# EAGLE design M220noadder (EAGLE 6.6.0)
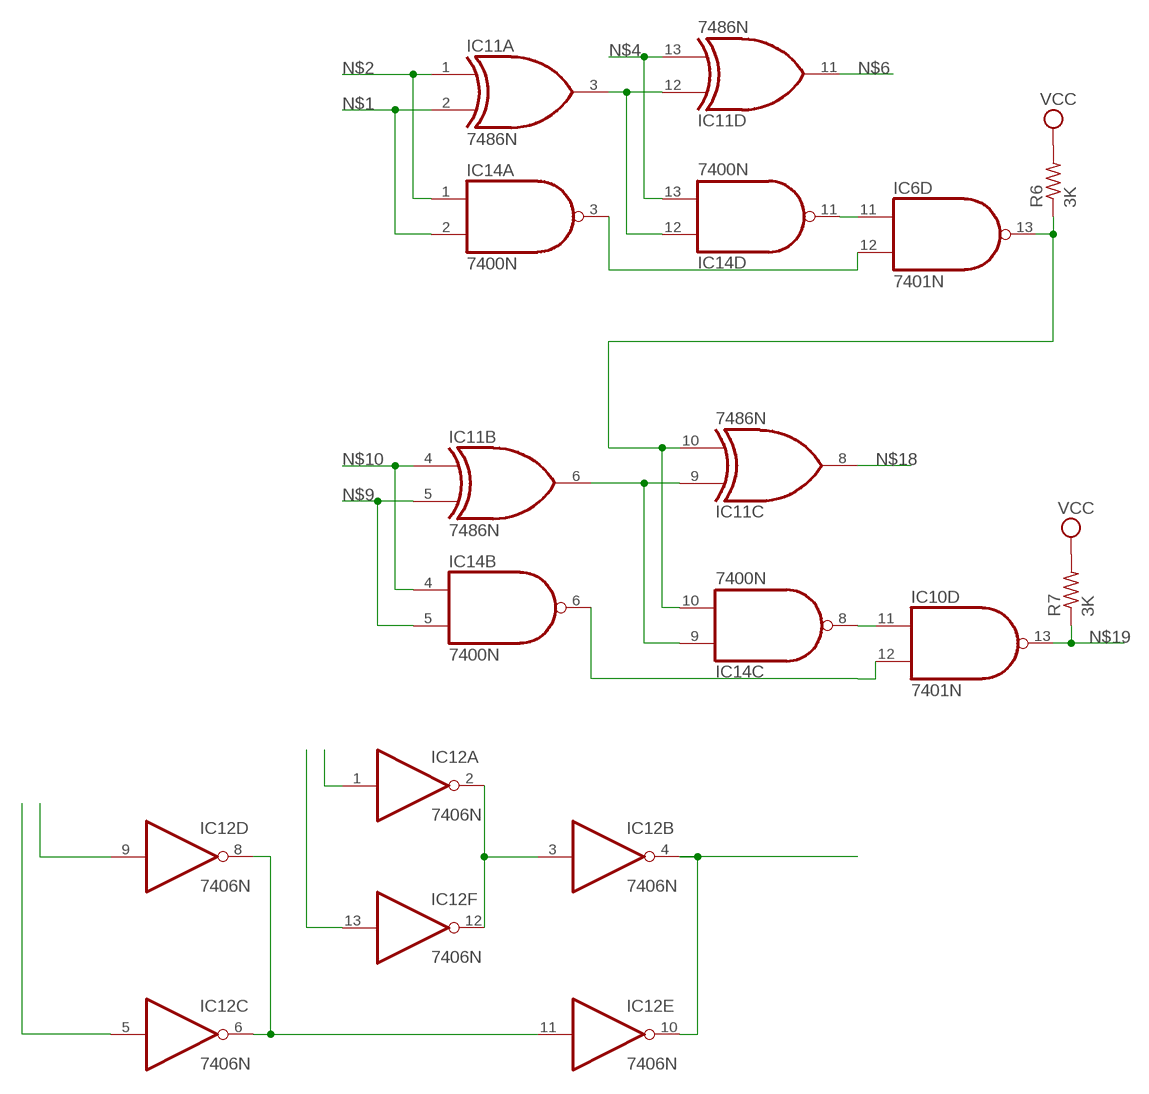
[diagram p0: schematic, sheet 1, part 1 of 2]
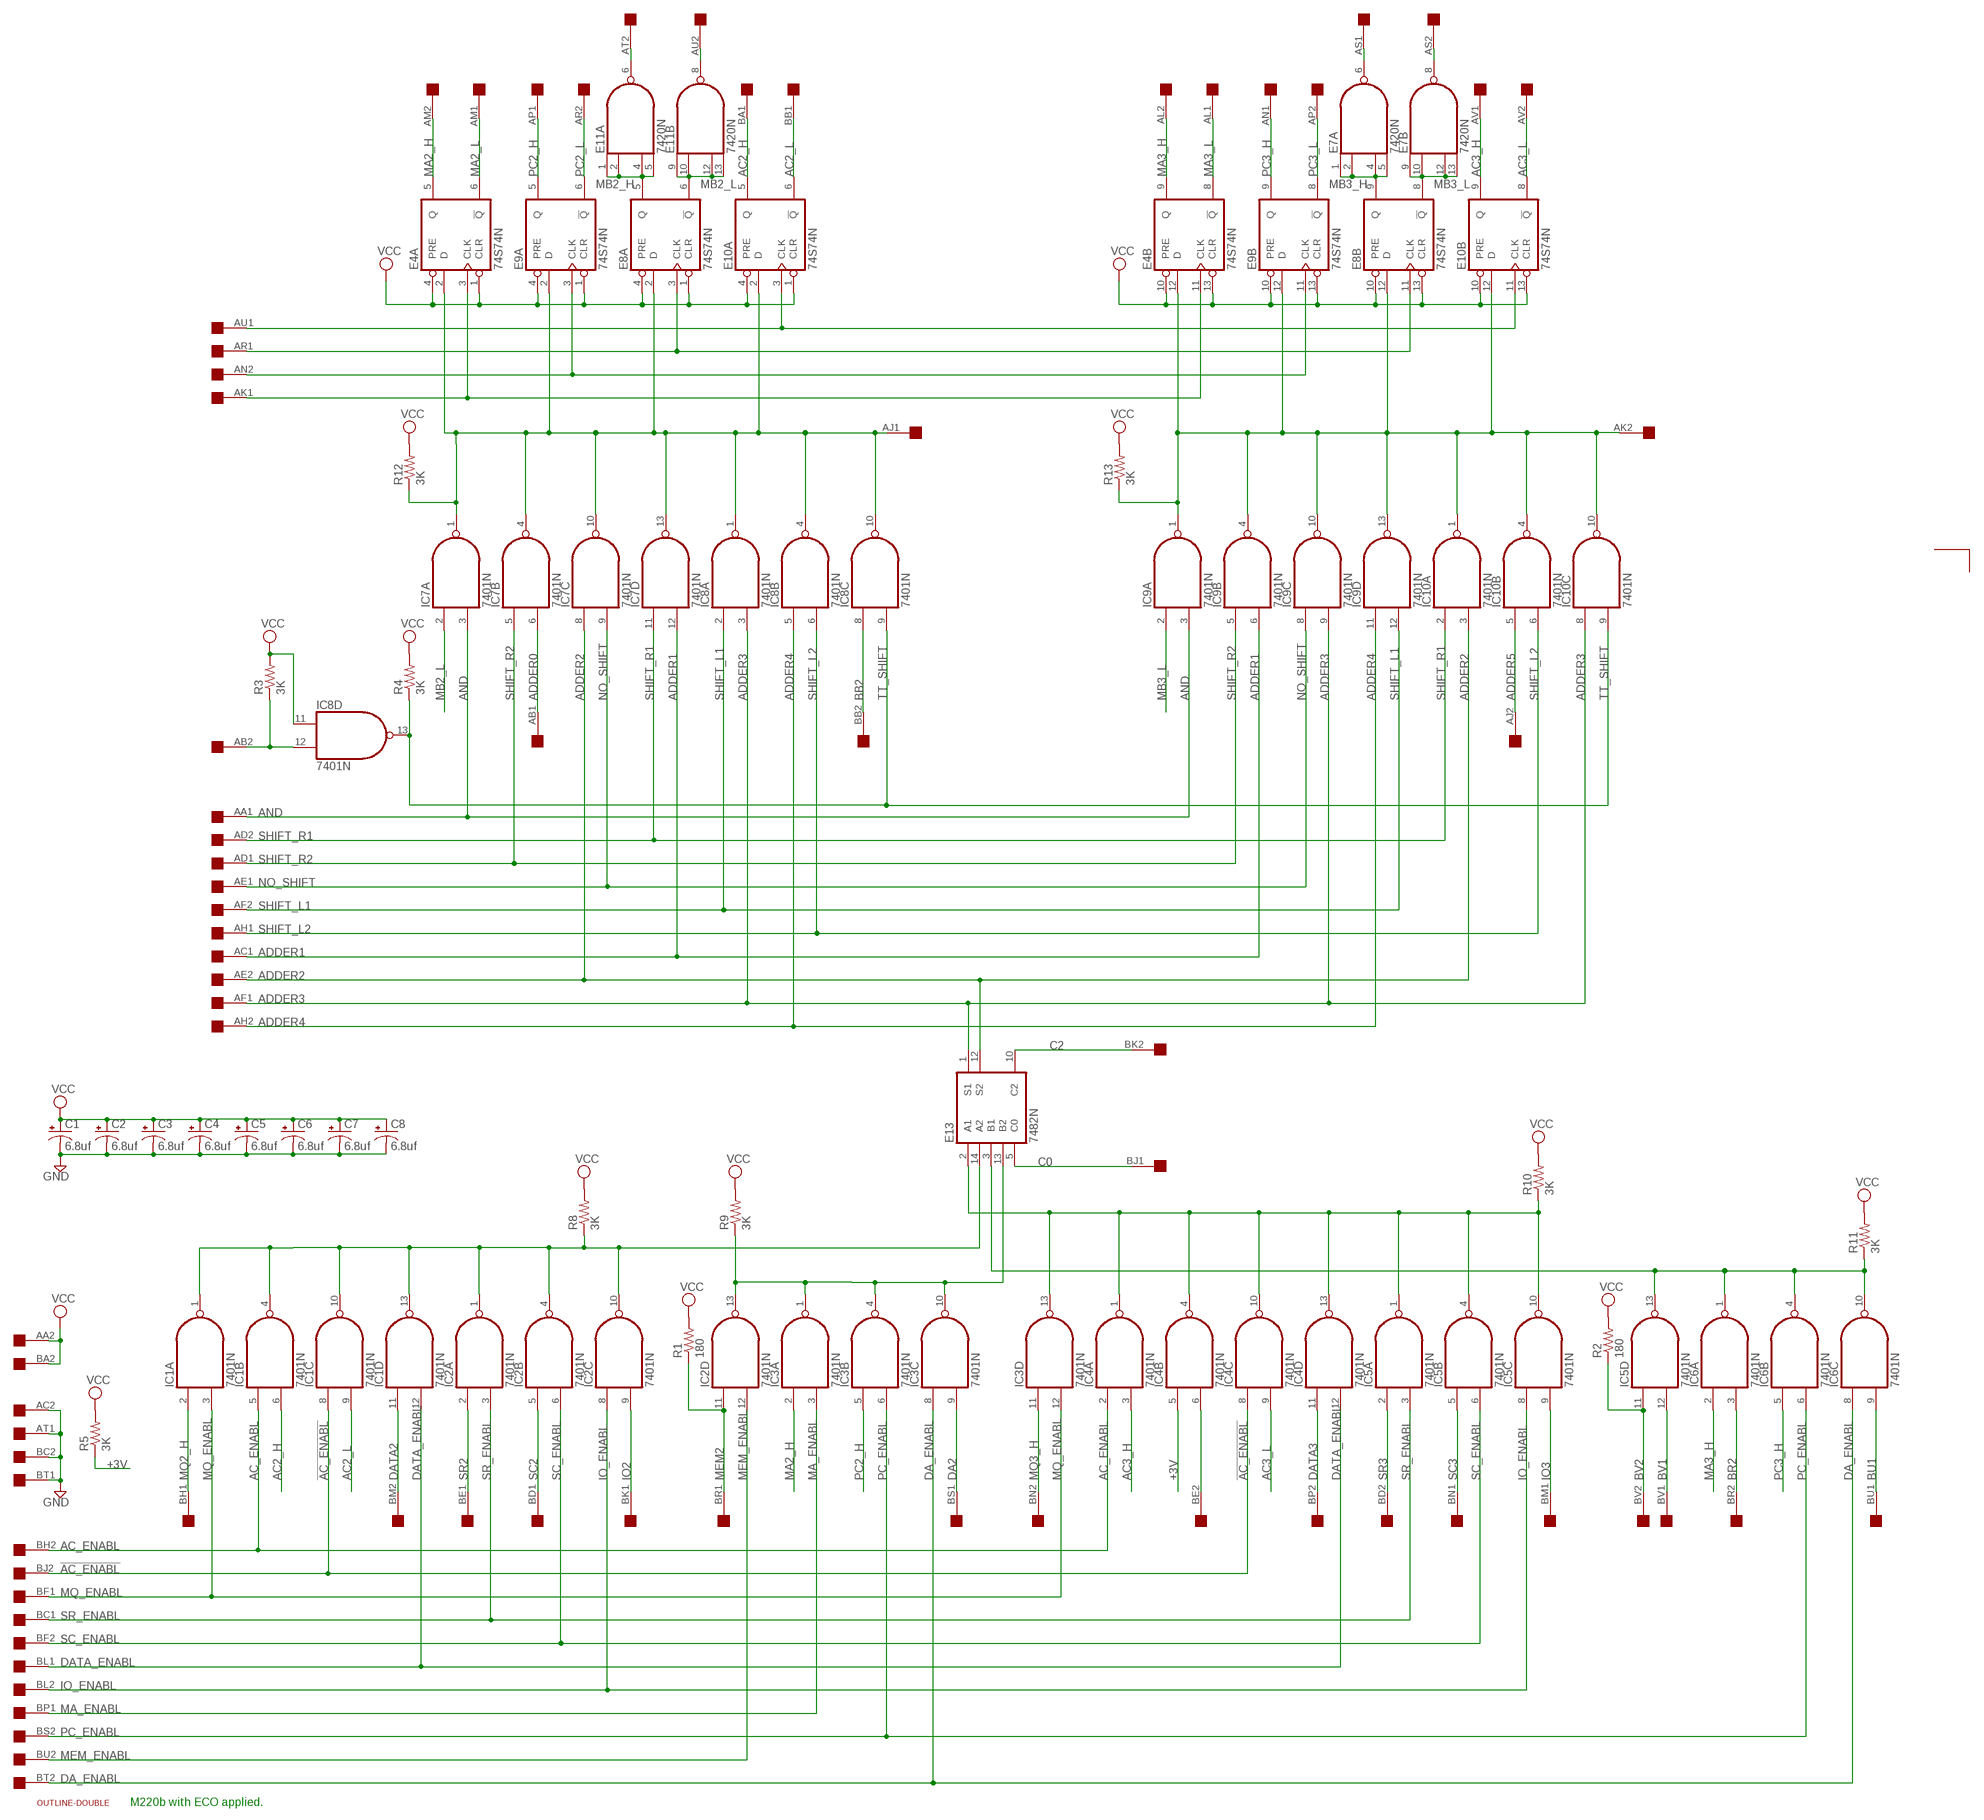
[diagram p1: schematic, sheet 1, part 2 of 2]

## Parts
C1  6.8uf  CPOL-USE15-5AXIAL  [E15-5]
C2  6.8uf  CPOL-USE15-5AXIAL  [E15-5]
C3  6.8uf  CPOL-USE15-5AXIAL  [E15-5]
C4  6.8uf  CPOL-USE15-5AXIAL  [E15-5]
C5  6.8uf  CPOL-USE15-5AXIAL  [E15-5]
C6  6.8uf  CPOL-USE15-5AXIAL  [E15-5]
C7  6.8uf  CPOL-USE15-5AXIAL  [E15-5]
C8  6.8uf  CPOL-USE15-5AXIAL  [E15-5]
E4  74S74N  [DIL14]
E7  7420N  74S20N  [DIL14]
E8  74S74N  [DIL14]
E9  74S74N  [DIL14]
E10  74S74N  [DIL14]
E11  7420N  74S20N  [DIL14]
E13  7482N  [DIL14]
IC1  7401N  [DIL14]
IC2  7401N  [DIL14]
IC3  7401N  [DIL14]
IC4  7401N  [DIL14]
IC5  7401N  [DIL14]
IC6  7401N  [DIL14]
IC7  7401N  [DIL14]
IC8  7401N  [DIL14]
IC9  7401N  [DIL14]
IC10  7401N  [DIL14]
IC11  7486N  [DIL14]
IC12  7406N  [DIL14]
IC14  7400N  [DIL14]
R1  180  R-US_0207/10  [0207/10]
R2  180  R-US_0207/10  [0207/10]
R3  3K  R-US_0207/10  [0207/10]
R4  3K  R-US_0207/10  [0207/10]
R5  3K  R-US_0207/10  [0207/10]
R6  3K  R-US_0207/10  [0207/10]
R7  3K  R-US_0207/10  [0207/10]
R8  3K  R-US_0207/10  [0207/10]
R9  3K  R-US_0207/10  [0207/10]
R10  3K  R-US_0207/10  [0207/10]
R11  3K  R-US_0207/10  [0207/10]
R12  3K  R-US_0207/10  [0207/10]
R13  3K  R-US_0207/10  [0207/10]
U$1  DOUBLE  [EDGE-CON4]
U$2  OUTLINE-DOUBLE  [DOUBLE]

## Nets
!AC_ENABL: IC1.8(C:I0) IC4.8(C:I0) U$1.BJ2
!TT_SHIFT: IC8.12(D:I1) R3.1 U$1.AB2
+3V: IC4.5(B:I0) R5.1
AC2_H: E10.5(A:Q) IC1.6(B:I1) U$1.BA1
AC2_L: E10.6(A:!Q) IC1.9(C:I1) U$1.BB1
AC3_H: E10.9(B:Q) IC4.3(A:I1) U$1.AV1
AC3_L: E10.8(B:!Q) IC4.9(C:I1) U$1.AV2
AC_ENABL: IC1.5(B:I0) IC4.2(A:I0) U$1.BH2
ADDER0: IC7.6(B:I1) U$1.AB1
ADDER1: IC7.12(D:I1) IC9.6(B:I1) U$1.AC1
ADDER2: E13.12(S2) IC7.8(C:I0) IC10.3(A:I1) U$1.AE2
ADDER3: E13.1(S1) IC8.3(A:I1) IC9.9(C:I1) IC10.8(C:I0) U$1.AF1
ADDER4: IC8.5(B:I0) IC9.11(D:I0) U$1.AH2
ADDER5: IC10.5(B:I0) U$1.AJ2
AJ1: E4.2(A:D) E8.2(A:D) E9.2(A:D) E10.2(A:D) IC7.1(A:O) IC7.4(B:O) IC7.10(C:O) IC7.13(D:O) IC8.1(A:O) IC8.4(B:O) IC8.10(C:O) R12.1 U$1.AJ1
AK1: E4.3(A:CLK) E4.11(B:CLK) U$1.AK1
AK2: E4.12(B:D) E8.12(B:D) E9.12(B:D) E10.12(B:D) IC9.1(A:O) IC9.4(B:O) IC9.10(C:O) IC9.13(D:O) IC10.1(A:O) IC10.4(B:O) IC10.10(C:O) R13.1 U$1.AK2
AN2: E9.3(A:CLK) E9.11(B:CLK) U$1.AN2
AND: IC7.3(A:I1) IC9.3(A:I1) U$1.AA1
AR1: E8.3(A:CLK) E8.11(B:CLK) U$1.AR1
AS1: E7.6(A:O) U$1.AS1
AS2: E7.8(B:O) U$1.AS2
AT2: E11.6(A:O) U$1.AT2
AU1: E10.3(A:CLK) E10.11(B:CLK) U$1.AU1
AU2: E11.8(B:O) U$1.AU2
BB2: IC8.8(C:I0) U$1.BB2
BE2: IC4.6(B:I1) U$1.BE2
BR2: IC6.3(A:I1) U$1.BR2
BU1: IC6.9(C:I1) U$1.BU1
BV1: IC5.12(D:I1) U$1.BV1
BV2: IC5.11(D:I0) R2.1 U$1.BV2
C0: E13.5(C0) U$1.BJ1
C2: E13.10(C2) U$1.BK2
DA2: IC3.9(C:I1) U$1.BS1
DA_ENABL: IC3.8(C:I0) IC6.8(C:I0) U$1.BT2
DATA2: IC1.11(D:I0) U$1.BM2
DATA3: IC4.11(D:I0) U$1.BP2
DATA_ENABL: IC1.12(D:I1) IC4.12(D:I1) U$1.BL1
GND: C1.- C2.- C3.- C4.- C5.- C6.- C7.- C8.- U$1.AC2 U$1.AT1 U$1.BC2 U$1.BT1
IO2: IC2.9(C:I1) U$1.BK1
IO3: IC5.9(C:I1) U$1.BM1
IO_ENABL: IC2.8(C:I0) IC5.8(C:I0) U$1.BL2
MA2_H: E4.5(A:Q) IC3.2(A:I0) U$1.AM2
MA2_L: E4.6(A:!Q) U$1.AM1
MA3_H: E4.9(B:Q) IC6.2(A:I0) U$1.AL2
MA3_L: E4.8(B:!Q) U$1.AL1
MA_ENABL: IC3.3(A:I1) U$1.BP1
MB2_H: E8.5(A:Q) E11.1(A:I0) E11.2(A:I1) E11.4(A:I2) E11.5(A:I3)
MB2_L: E8.6(A:!Q) E11.9(B:I0) E11.10(B:I1) E11.12(B:I2) E11.13(B:I3) IC7.2(A:I0)
MB3_H: E7.1(A:I0) E7.2(A:I1) E7.4(A:I2) E7.5(A:I3) E8.9(B:Q)
MB3_L: E7.9(B:I0) E7.10(B:I1) E7.12(B:I2) E7.13(B:I3) E8.8(B:!Q) IC9.2(A:I0)
MEM2: IC2.11(D:I0) R1.1 U$1.BR1
MEM_ENABL: IC2.12(D:I1) U$1.BU2
MQ2_H: IC1.2(A:I0) U$1.BH1
MQ3_H: IC3.11(D:I0) U$1.BN2
MQ_ENABL: IC1.3(A:I1) IC3.12(D:I1) U$1.BF1
N$1: IC11.2(A:I1) IC14.2(A:I1)
N$2: IC11.1(A:I0) IC14.1(A:I0)
N$3: IC11.3(A:O) IC11.12(D:I0) IC14.12(D:I0)
N$4: IC11.13(D:I1) IC14.13(D:I1)
N$5: E13.14(A2) IC1.1(A:O) IC1.4(B:O) IC1.10(C:O) IC1.13(D:O) IC2.1(A:O) IC2.4(B:O) IC2.10(C:O) R8.1
N$6: IC11.11(D:O)
N$7: IC6.12(D:I1) IC14.3(A:O)
N$8: E13.2(A1) IC3.13(D:O) IC4.1(A:O) IC4.4(B:O) IC4.10(C:O) IC4.13(D:O) IC5.1(A:O) IC5.4(B:O) IC5.10(C:O) R10.1
N$9: IC11.5(B:I1) IC14.5(B:I1)
N$10: IC11.4(B:I0) IC14.4(B:I0)
N$11: IC11.6(B:O) IC11.9(C:I0) IC14.9(C:I0)
N$12: E13.13(B2) IC2.13(D:O) IC3.1(A:O) IC3.4(B:O) IC3.10(C:O) R9.1
N$13: IC6.13(D:O) IC11.10(C:I1) IC14.10(C:I1) R6.1
N$14: E13.3(B1) IC5.13(D:O) IC6.1(A:O) IC6.4(B:O) IC6.10(C:O) R11.1
N$15: IC10.12(D:I1) IC14.6(B:O)
N$16: IC6.11(D:I0) IC14.11(D:O)
N$17: IC10.11(D:I0) IC14.8(C:O)
N$18: IC11.8(C:O)
N$19: IC10.13(D:O) R7.1
N$20: IC12.5(C:I)
N$21: IC12.9(D:I)
N$22: IC12.6(C:O) IC12.8(D:O) IC12.11(E:I)
N$23: IC12.13(F:I)
N$24: IC12.1(A:I)
N$25: IC12.2(A:O) IC12.3(B:I) IC12.12(F:O)
N$26: IC12.4(B:O) IC12.10(E:O)
NO_SHIFT: IC7.9(C:I1) IC9.8(C:I0) U$1.AE1
PC2_H: E9.5(A:Q) IC3.5(B:I0) U$1.AP1
PC2_L: E9.6(A:!Q) U$1.AR2
PC3_H: E9.9(B:Q) IC6.5(B:I0) U$1.AN1
PC3_L: E9.8(B:!Q) U$1.AP2
PC_ENABL: IC3.6(B:I1) IC6.6(B:I1) U$1.BS2
SC2: IC2.5(B:I0) U$1.BD1
SC3: IC5.5(B:I0) U$1.BN1
SC_ENABL: IC2.6(B:I1) IC5.6(B:I1) U$1.BF2
SHIFT_L1: IC8.2(A:I0) IC9.12(D:I1) U$1.AF2
SHIFT_L2: IC8.6(B:I1) IC10.6(B:I1) U$1.AH1
SHIFT_R1: IC7.11(D:I0) IC10.2(A:I0) U$1.AD2
SHIFT_R2: IC7.5(B:I0) IC9.5(B:I0) U$1.AD1
SR2: IC2.2(A:I0) U$1.BE1
SR3: IC5.2(A:I0) U$1.BD2
SR_ENABL: IC2.3(A:I1) IC5.3(A:I1) U$1.BC1
TT_SHIFT: IC8.9(C:I1) IC8.13(D:O) IC10.9(C:I1) R4.1
VCC: C1.+ C2.+ C3.+ C4.+ C5.+ C6.+ C7.+ C8.+ E4.1(A:CLR) E4.4(A:PRE) E4.10(B:PRE) E4.13(B:CLR) E8.1(A:CLR) E8.4(A:PRE) E8.10(B:PRE) E8.13(B:CLR) E9.1(A:CLR) E9.4(A:PRE) E9.10(B:PRE) E9.13(B:CLR) E10.1(A:CLR) E10.4(A:PRE) E10.10(B:PRE) E10.13(B:CLR) IC8.11(D:I0) R1.2 R2.2 R3.2 R4.2 R5.2 R6.2 R7.2 R8.2 R9.2 R10.2 R11.2 R12.2 R13.2 U$1.AA2 U$1.BA2

## Notes on the sheet
- M220b with ECO applied.

## Power pins joined to a net without a drawn wire
GND: E4.7(P:GND) E7.7(P:GND) E8.7(P:GND) E9.7(P:GND) E10.7(P:GND) E11.7(P:GND) E13.7(GND) IC1.7(P:GND) IC2.7(P:GND) IC3.7(P:GND) IC4.7(P:GND) IC5.7(P:GND) IC6.7(P:GND) IC7.7(P:GND) IC8.7(P:GND) IC9.7(P:GND) IC10.7(P:GND) IC11.7(P:GND) IC12.7(P:GND) IC14.7(P:GND)
VCC: E4.14(P:VCC) E7.14(P:VCC) E8.14(P:VCC) E9.14(P:VCC) E10.14(P:VCC) E11.14(P:VCC) E13.4(VCC) IC1.14(P:VCC) IC2.14(P:VCC) IC3.14(P:VCC) IC4.14(P:VCC) IC5.14(P:VCC) IC6.14(P:VCC) IC7.14(P:VCC) IC8.14(P:VCC) IC9.14(P:VCC) IC10.14(P:VCC) IC11.14(P:VCC) IC12.14(P:VCC) IC14.14(P:VCC)

## Library data of the parts
C1-C8 = rcl:CPOL-US: POLARIZED CAPACITOR, American symbol
E4 E8-E10 = 74xx-us:74*74: Dual D type positive edge triggered FLIP FLOP, preset and clear
E7 E11 = 74xx-jameco:74*20: Dual 4-input NAND gate
E13 = 74xx-eu:74*82: 2-bit binary full ADDER
IC1-IC10 = 74xx-jameco:74*01: Quad 2-input NAND gate, open collector
IC11 = 74xx-jameco:74*86: Quad 2-input EXCLUSIV-OR (XOR) gate
IC12 = 74xx-jameco:74*06: Hex INVERTER, open collector high-voltage output
IC14 = 74xx-jameco:74*00: Quad 2-input NAND gate
R1-R13 = rcl:R-US_: RESISTOR, American symbol
U$1 = dec-con:DOUBLE: Double-Height DEC board
U$2 = dec-con:OUTLINE-*: Board outlines for DEC boards.

## Board
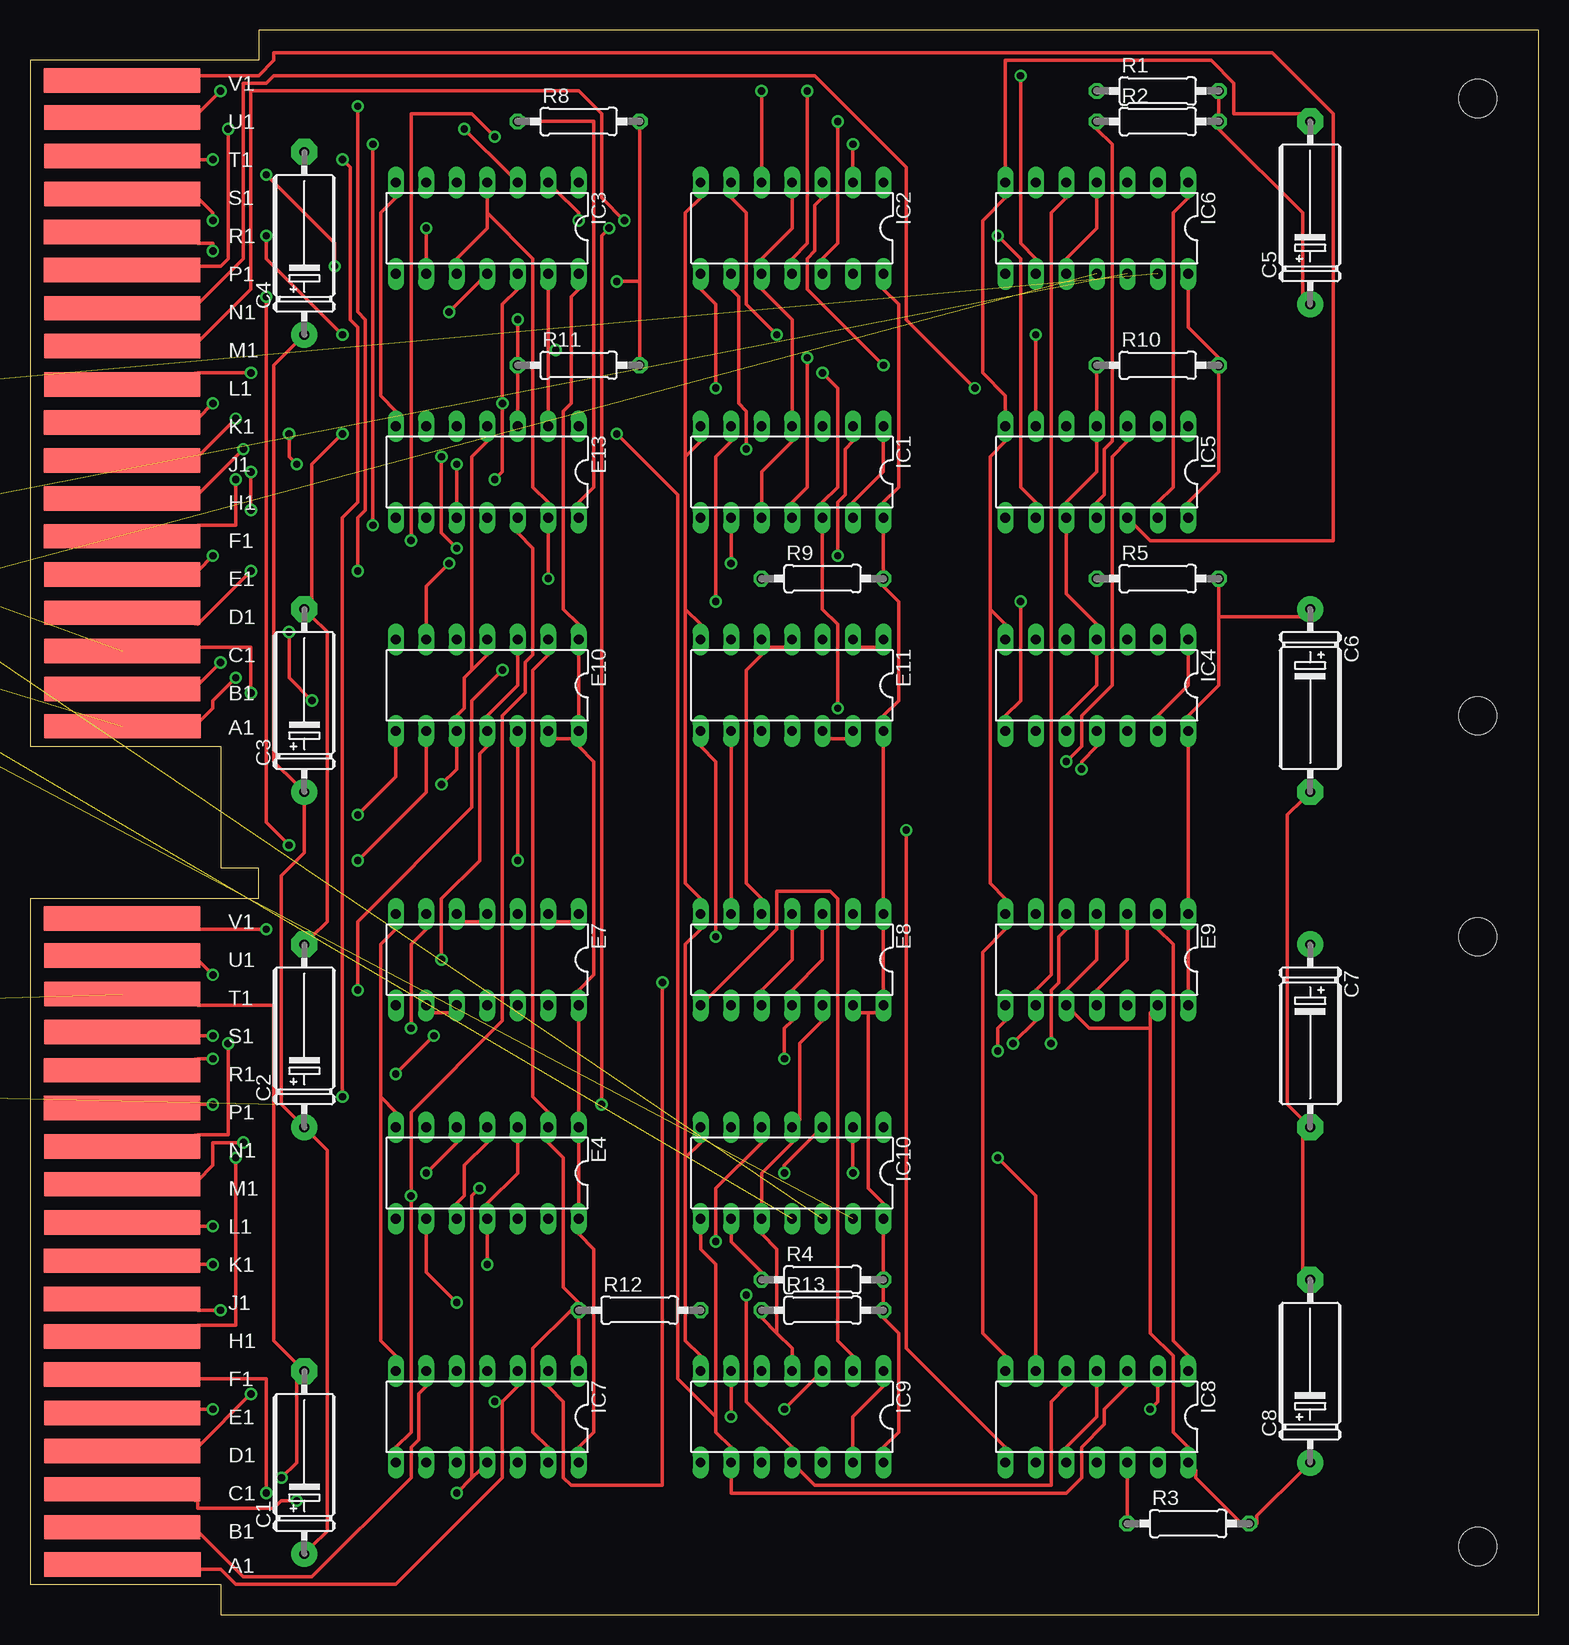
[diagram p2: board, top side]
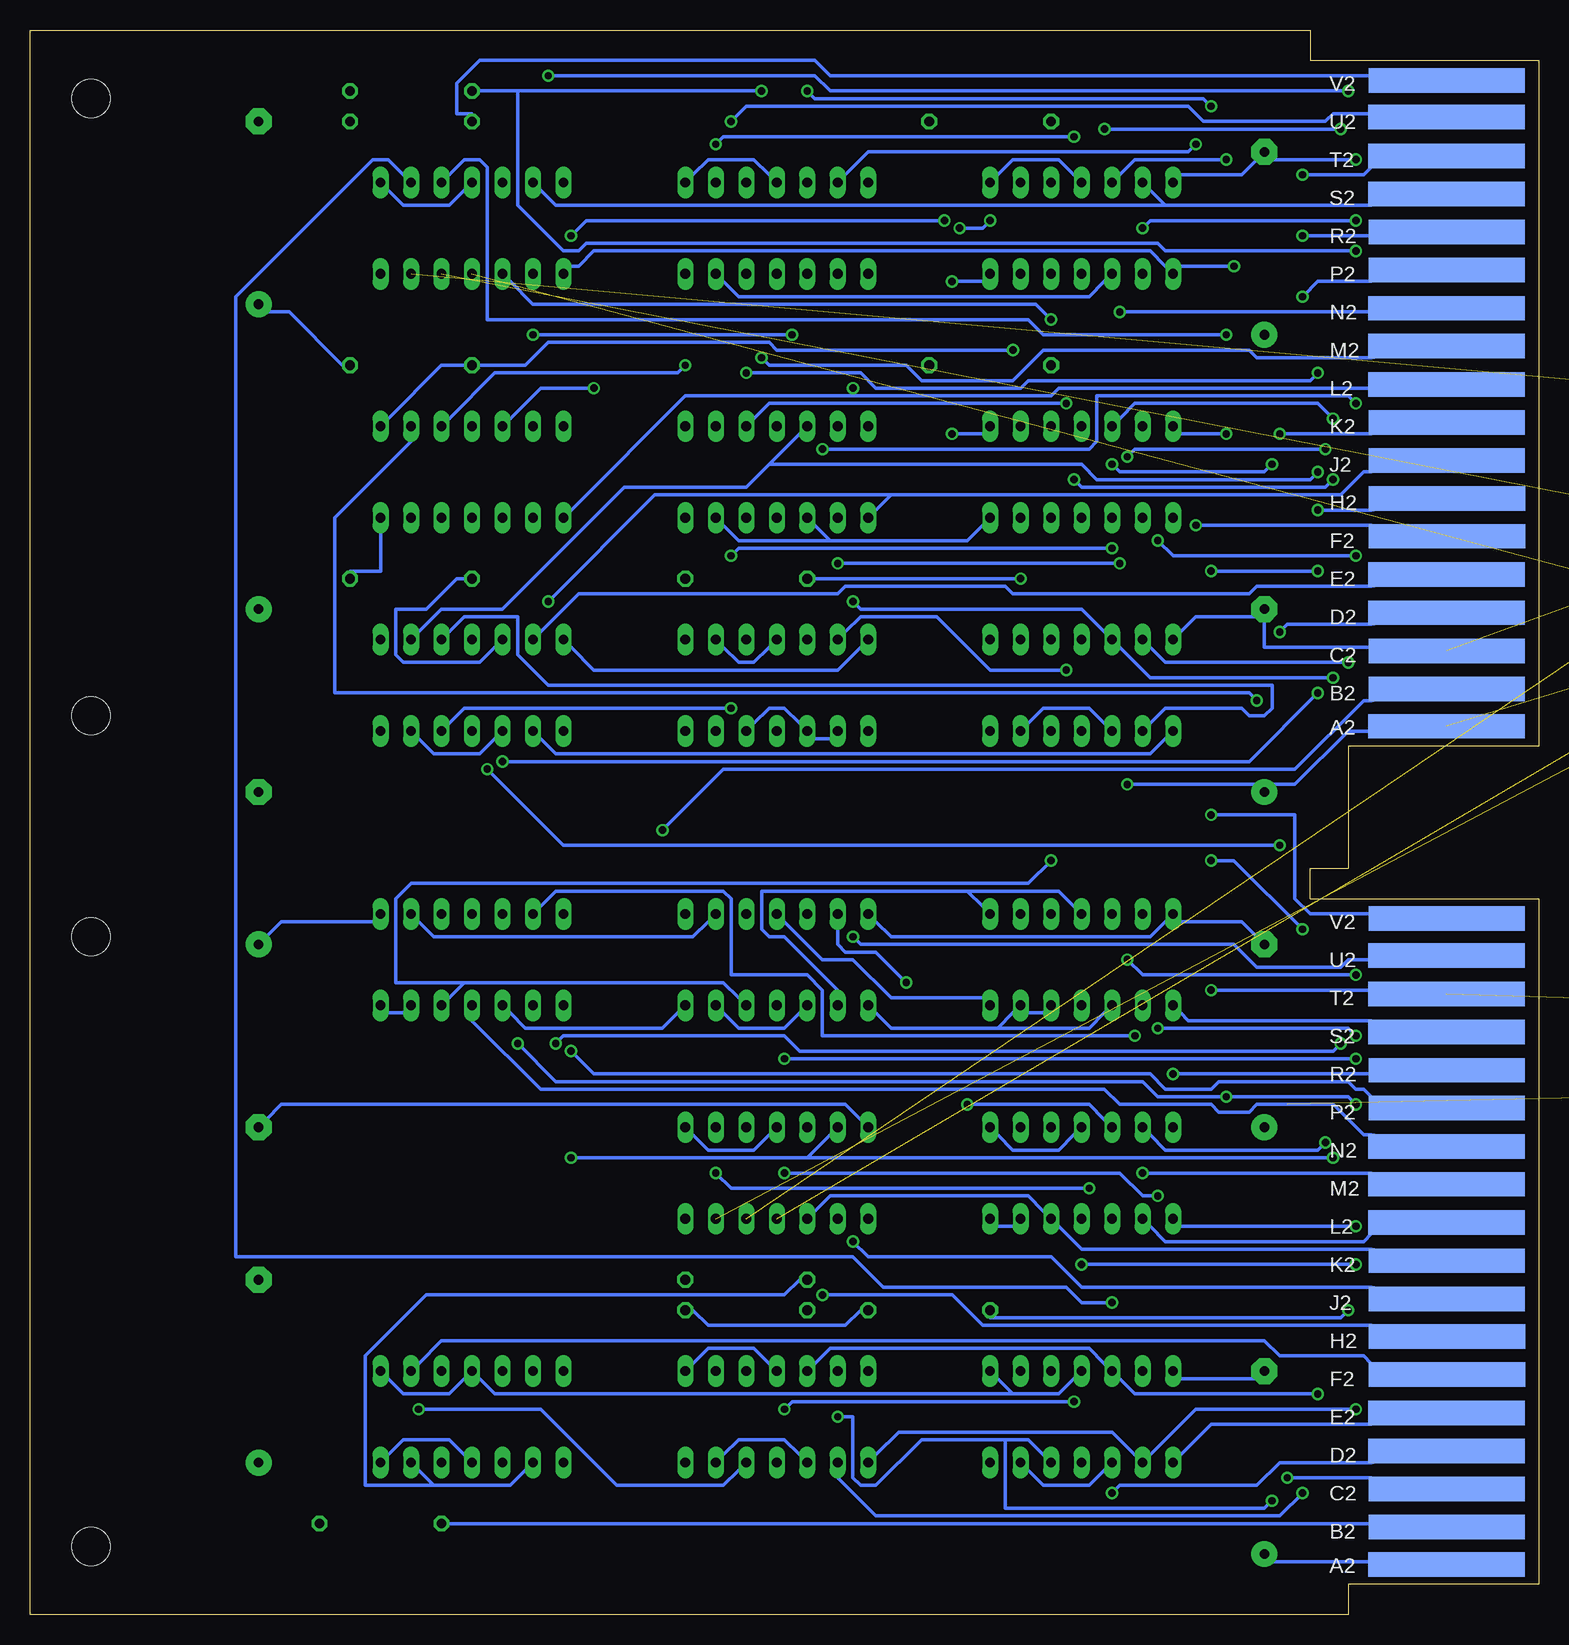
[diagram p3: board, bottom side, seen from below]

Size 125.73 x 132.08 mm. Coordinates in mm from the lower left corner, seen from the top.
Copper layers (1*16): Top 0.035mm / dielectric 1.5mm / Bottom 0.035mm
Design rules "olimex10mil": minimum track width 12mil, minimum drill 24mil, track to track 12mil, track to pad 12mil, pad to pad 12mil, via to via 12mil, smd to smd 10mil, copper to edge 25mil, drill to drill 10mil, minimum pad ring 10mil, minimum via ring 8mil, stop-mask expansion 0mil, vias tented up to drill 0mil, thermal gap 10mil

### Footprints (pad centres in the part's own frame; a part is rotated, then mirrored left to right if it is on the bottom)
E15-5 = drill 0.813 pad 2.159: + -7.62,0 | drill 0.813 pad 2.159 octagon: - 7.62,0
DIL14 = drill 0.813 long: 1 -7.62,-3.81; 2 -5.08,-3.81; 3 -2.54,-3.81; 4 0,-3.81; 5 2.54,-3.81; 6 5.08,-3.81; 7 7.62,-3.81; 8 7.62,3.81; 9 5.08,3.81; 10 2.54,3.81; 11 0,3.81; 12 -2.54,3.81; 13 -5.08,3.81; 14 -7.62,3.81
0207/10 = drill 0.813 octagon: 1 -5.08,0; 2 5.08,0
EDGE-CON4 = smd 13.017 x 2.032: AA1 7.709,4.207; AB1 7.684,7.312; AC1 7.684,10.474; AD1 7.684,13.665; AE1 7.693,16.84; AF1 7.668,20.041; AH1 7.668,23.19; AJ1 7.668,26.34; AK1 7.668,29.515; AL1 7.693,32.69; AM1 7.693,35.89; AN1 7.693,39.04; AP1 7.668,42.24; AR1 7.668,45.39; AS1 7.693,48.565; AT1 7.693,51.74; AU1 7.693,54.94; AV1 7.668,58.026; BA1 7.709,74.057; BB1 7.684,77.162; BC1 7.684,80.324; BD1 7.684,83.515; BE1 7.693,86.69; BF1 7.668,89.891; BH1 7.668,93.04; BJ1 7.668,96.19; BK1 7.668,99.365; BL1 7.693,102.54; BM1 7.693,105.74; BN1 7.693,108.89; BP1 7.668,112.09; BR1 7.668,115.24; BS1 7.693,118.415; BT1 7.693,121.59; BU1 7.693,124.79; BV1 7.668,127.876 | smd 13.017 x 2.032 bottom: AA2 7.69,4.207; AB2 7.668,7.328; AC2 7.668,10.49; AD2 7.693,13.665; AE2 7.693,16.84; AF2 7.642,20.041; AH2 7.642,23.19; AJ2 7.668,26.34; AK2 7.668,29.515; AL2 7.693,32.69; AM2 7.693,35.89; AN2 7.693,39.04; AP2 7.668,42.24; AR2 7.668,45.39; AS2 7.693,48.565; AT2 7.693,51.74; AU2 7.693,54.966; AV2 7.668,58.026; BA2 7.69,74.057; BB2 7.668,77.178; BC2 7.668,80.34; BD2 7.693,83.515; BE2 7.693,86.69; BF2 7.642,89.891; BH2 7.642,93.04; BJ2 7.668,96.19; BK2 7.668,99.365; BL2 7.693,102.54; BM2 7.693,105.74; BN2 7.693,108.89; BP2 7.668,112.09; BR2 7.668,115.24; BS2 7.693,118.415; BT2 7.693,121.59; BU2 7.693,124.816; BV2 7.668,127.876
DOUBLE = hole 3.175: 120.65,56.515; 120.65,5.715; 120.65,74.93; 120.65,126.365

### Placement (x,y rotation side)
C1  22.86,12.7 90 top
C2  22.86,48.26 90 top
C3  22.86,76.2 90 top
C4  22.86,114.3 90 top
C5  106.68,116.84 90 top
C6  106.68,76.2 270 top
C7  106.68,48.26 270 top
C8  106.68,20.32 90 top
E4  38.1,36.83 180 top
E7  38.1,54.61 180 top
E8  63.5,54.61 180 top
E9  88.9,54.61 180 top
E10  38.1,77.47 180 top
E11  63.5,77.47 180 top
E13  38.1,95.25 180 top
IC1  63.5,95.25 180 top
IC2  63.5,115.57 180 top
IC3  38.1,115.57 180 top
IC4  88.9,77.47 180 top
IC5  88.9,95.25 180 top
IC6  88.9,115.57 180 top
IC7  38.1,16.51 180 top
IC8  88.9,16.51 180 top
IC9  63.5,16.51 180 top
IC10  63.5,36.83 180 top
IC11  -15.24,105.41 180 top  (outside the outline)
IC12  -15.24,46.99 180 top  (outside the outline)
IC14  -15.24,87.63 180 top  (outside the outline)
R1  93.98,127 0 top
R2  93.98,124.46 0 top
R3  96.52,7.62 0 top
R4  66.04,27.94 0 top
R5  93.98,86.36 0 top
R6  -12.7,96.52 0 top  (outside the outline)
R7  -12.7,78.74 0 top  (outside the outline)
R8  45.72,124.46 0 top
R9  66.04,86.36 0 top
R10  93.98,104.14 0 top
R11  45.72,104.14 0 top
R12  50.8,25.4 0 top
R13  66.04,25.4 0 top
U$1  0,0 0 top
U$2  0,0 0 top

### Tracks (layer width: path | path; a pad name or v marks a point on that pad's centre or on a via)
!AC_ENABL  (via drill 0.61)
  Top 0.305: v82.55,84.45 82.55,76.2 81.28,74.93 IC4.8
  Bottom 0.305: 53.98,93.34 55.25,92.08 IC1.8 | 53.98,93.34 16.51,93.34 14.61,95.25 13.97,95.25 U$1.BJ2 | v82.55,84.45 73.66,93.34 53.98,93.34
!TT_SHIFT
  Top 0.305: R3.1 91.44,8.26 91.44,11.43 IC8.12
  Bottom 0.305: R3.1 90.81,7.62 13.97,7.62 U$1.AB2
+3V
  Bottom 0.305: IC4.5 87,80.64 88.27,79.38 94.62,79.38 95.25,80.01 95.25,83.82 92.71,83.82 90.17,86.36 89.54,86.36 R5.1
AC2_H  (via drill 0.61)
  Top 0.305: v17.15,78.11 15.24,76.2 15.24,75.56 13.97,74.3 U$1.BA1 | v57.15,84.45 57.15,96.52 58.42,97.79 IC1.6
  Bottom 0.305: v17.15,78.11 32.39,78.11 34.93,80.64 E10.5 36.2,81.92 38.1,83.82 56.52,83.82 v57.15,84.45
AC2_L  (via drill 0.61)
  Top 0.305: v15.88,79.38 13.97,77.47 U$1.BB1 | v58.42,87.63 58.42,90.17 IC1.9 | v34.93,87.63 33.02,85.72 33.02,82.55 E10.6
  Bottom 0.305: v15.88,79.38 31.12,79.38 32.39,80.64 E10.6 | v34.93,87.63 v58.42,87.63
AC3_H  (via drill 0.61)
  Top 0.305: v19.69,57.15 13.97,57.15 U$1.AV1 | v27.31,62.87 33.02,68.58 33.02,72.39 E10.9
  Bottom 0.305: E10.9 32.39,74.3 31.12,75.56 24.77,75.56 24.13,74.93 22.86,74.93 22.23,75.56 22.23,77.47 82.55,77.47 85.09,80.01 85.09,83.19 89.54,83.19 90.81,81.92 IC4.3 | v19.69,57.15 25.4,62.87 v27.31,62.87
AC3_L  (via drill 0.61)
  Top 0.305: v27.31,66.67 30.48,69.85 30.48,72.39 E10.8
  Bottom 0.305: E10.8 31.12,73.03 32.39,71.75 81.92,71.75 83.19,73.03 IC4.9 | v27.31,66.67 20.32,66.67 20.32,59.69 19.05,58.42 13.97,58.42 U$1.AV2
AC_ENABL  (via drill 0.61)
  Top 0.305: v18.42,92.08 v18.42,95.25
  Bottom 0.305: 64.14,95.89 66.04,93.98 76.2,93.98 86.36,83.82 91.44,83.82 93.35,81.92 IC4.2 | 64.14,95.89 61.6,98.42 IC1.5 | v18.42,92.08 13.97,92.08 U$1.BH2 | v18.42,95.25 19.05,94.61 36.83,94.61 38.1,95.89 64.14,95.89
ADDER0
  Top 0.305: IC7.6 33.02,19.05 32.39,18.41 32.39,14.61 31.75,13.97 31.75,11.43 23.5,3.17 17.78,3.17 13.97,6.99 U$1.AB1
ADDER1  (via drill 0.61)
  Top 0.305: v58.42,16.51 58.42,19.05 IC9.6 | v22.23,9.53 20.96,9.53 20.32,8.89 13.97,8.89 13.97,9.53 U$1.AC1
  Bottom 0.305: 44.45,14.61 51.44,14.61 55.25,10.79 56.52,10.79 57.15,11.43 57.15,16.51 v58.42,16.51 | 44.45,14.61 42.55,14.61 41.28,13.34 IC7.12 | 44.45,14.61 44.45,8.89 22.86,8.89 v22.23,9.53
ADDER2  (via drill 0.61)
  Top 0.305: v62.87,36.83 62.87,37.47 65.41,40.01 IC10.3 | IC7.8 30.48,13.97 31.75,15.24 v31.75,34.92 31.75,41.91 39.37,49.53 39.37,74.93 41.28,76.83 41.28,79.38 41.91,80.01 41.91,88.9 40.64,90.17 E13.12
  Bottom 0.305: IC7.8 29.85,13.34 27.31,15.88 13.97,15.88 U$1.AE2 | v62.87,36.83 34.93,36.83 33.02,34.92 v31.75,34.92
ADDER3  (via drill 0.61)
  Top 0.305: 57.15,16.51 57.15,29.21 55.88,30.48 55.88,31.75 IC10.8 | 57.15,16.51 57.15,15.24 58.42,13.97 IC9.9 58.42,11.43 58.42,10.16 86.36,10.16 87.63,11.43 87.63,13.97 89.54,15.88 89.54,17.14 91.44,19.05 IC8.3 | v48.9,98.42 53.98,93.34 53.98,19.68 57.15,16.51 | v19.69,10.16 19.69,19.68 13.97,19.68 U$1.AF1
  Bottom 0.305: v48.9,98.42 46.36,98.42 E13.1 | v19.69,10.16 21.59,8.26 55.25,8.26 58.42,11.43 IC9.9
ADDER4  (via drill 0.61)
  Top 0.305: IC8.5 86.36,19.05 85.09,17.78 85.09,10.79 65.41,10.79 64.14,12.06 IC9.11 63.5,13.97 59.69,17.78 v59.69,26.67
  Bottom 0.305: v59.69,26.67 48.9,26.67 46.36,24.13 13.97,24.13 U$1.AH2
ADDER5  (via drill 0.61)
  Top 0.305: v57.15,31.11 57.15,35.56 60.96,39.37 IC10.5
  Bottom 0.305: v57.15,31.11 55.88,29.84 40.64,29.84 38.1,27.3 13.97,27.3 U$1.AJ2
AJ1  (via drill 0.61)
  Top 0.305: IC8.10 86.36,13.97 88.9,16.51 88.9,19.05 IC8.4 | IC8.1 96.52,21.59 95.25,22.86 95.25,55.88 93.98,57.15 E9.2 | R12.1 45.72,24.77 45.72,21.59 IC7.1 | R12.1 45.72,26.04 44.45,27.3 44.45,38.1 43.18,39.37 E4.2 43.18,41.91 41.91,43.18 41.91,78.74 43.18,80.01 E10.2 | IC7.13 43.18,13.97 41.91,15.24 41.91,22.23 45.09,25.4 R12.1 | v15.88,25.4 13.97,25.4 U$1.AJ1
  Bottom 0.305: IC8.1 95.89,19.68 94.62,18.41 90.81,18.41 89.54,19.68 IC8.4 88.27,19.68 87,18.41 43.82,18.41 | E8.2 69.22,57.78 70.49,56.52 92.08,56.52 93.35,57.78 E9.2 | IC7.10 36.2,12.06 37.47,10.79 41.28,10.79 42.55,12.06 IC7.13 | 43.82,18.41 40.01,18.41 38.74,19.68 IC7.4 | 43.82,18.41 45.09,19.68 IC7.1 | v15.88,25.4 16.51,24.77 45.72,24.77 R12.1
AK1  (via drill 0.61)
  Top 0.305: E4.3 40.64,39.37 40.64,36.83 38.1,34.29 E4.11 38.1,31.75 v38.1,29.21 | v15.24,29.21 13.97,29.21 U$1.AK1
  Bottom 0.305: v15.24,29.21 v38.1,29.21
AK2  (via drill 0.61)
  Top 0.305: IC9.1 71.12,19.05 68.58,16.51 68.58,13.97 IC9.13 | 62.23,23.5 63.5,22.23 63.5,21.59 IC9.4 | 62.23,23.5 60.96,24.77 R13.1 | 62.23,23.5 62.23,30.48 60.96,31.75 IC10.10 60.96,34.29 60.96,36.83 63.5,39.37 IC10.4 64.14,41.27 64.14,47.62 66.04,49.53 E8.12 | v40.64,62.87 40.64,72.39 E10.12
  Bottom 0.305: U$1.AK2 13.97,30.48 38.1,30.48 40.01,32.38 E4.12 41.28,33.66 42.55,34.92 59.06,34.92 60.33,33.66 IC10.10 | IC9.10 61.6,13.34 62.87,14.61 66.68,14.61 67.95,13.34 IC9.13 | IC10.1 70.49,40.01 69.22,38.73 65.41,38.73 64.14,40.01 IC10.4 | 89.54,52.7 90.81,51.44 E9.12 | 89.54,52.7 67.95,52.7 66.68,51.44 E8.12 | v40.64,62.87 42.55,60.96 93.98,60.96 95.25,59.69 95.25,52.7 89.54,52.7 | IC9.1 70.49,20.95 69.22,22.23 65.41,22.23 64.14,20.95 IC9.4
AN2
  Top 0.305: E9.11 88.9,52.07 91.44,54.61 91.44,57.15 E9.3
  Bottom 0.305: E9.11 88.9,49.53 83.19,43.81 36.2,43.81 34.93,42.55 27.31,42.55 26.67,41.91 24.13,41.91 23.5,42.55 17.15,42.55 14.61,40.01 13.97,40.01 U$1.AN2
AND  (via drill 0.61)
  Top 0.305: 39.37,17.78 40.64,19.05 IC7.3 | 39.37,17.78 39.37,11.43 30.48,2.54 17.15,2.54 15.88,3.81 13.97,3.81 U$1.AA1 | v62.87,17.14 65.41,19.68 IC9.3 | 39.37,17.78 v38.74,17.78
  Bottom 0.305: v62.87,17.14 62.23,17.78 v38.74,17.78
AR1  (via drill 0.61)
  Top 0.305: E8.3 66.04,57.15 66.04,54.61 63.5,52.07 E8.11 63.5,49.53 62.87,48.9 v62.87,46.35 | v15.24,46.35 13.97,46.35 U$1.AR1
  Bottom 0.305: v15.24,46.35 v62.87,46.35
AS1  (via drill 0.61)
  Top 0.305: v31.75,48.9 31.75,55.88 33.02,57.15 E7.6 | v15.24,48.26 13.97,48.26 U$1.AS1
  Bottom 0.305: v31.75,48.9 15.88,48.9 v15.24,48.26
AS2
  Bottom 0.305: E7.8 29.85,50.16 29.21,49.53 13.97,49.53 U$1.AS2
AT2  (via drill 0.61)
  Top 0.305: v39.37,78.74 36.83,76.2 36.83,67.31 27.31,57.78 v27.31,52.07
  Bottom 0.305: v39.37,78.74 45.72,78.74 50.17,83.19 56.52,83.19 57.79,81.92 E11.6 | v27.31,52.07 13.97,52.07 U$1.AT2
AU1  (via drill 0.61)
  Top 0.305: E10.3 40.64,80.01 40.64,77.47 38.1,74.93 E10.11 38.1,72.39 37.47,71.75 37.47,62.87 34.29,59.69 v34.29,54.61 | v15.24,53.34 13.97,54.61 U$1.AU1
  Bottom 0.305: v34.29,54.61 33.02,53.34 v15.24,53.34
AU2  (via drill 0.61)
  Top 0.305: v57.15,56.52 57.15,71.12 55.88,72.39 E11.8
  Bottom 0.305: v57.15,56.52 56.52,55.88 25.4,55.88 23.5,53.98 16.51,53.98 15.88,54.61 13.97,54.61 U$1.AU2
BB2  (via drill 0.61)
  Top 0.305: v73.03,65.41 73.03,22.23 81.28,13.97 IC8.8
  Bottom 0.305: v73.03,65.41 67.95,70.48 20.32,70.48 14.61,76.2 13.97,76.2 U$1.BB2
BE2
  Bottom 0.305: IC4.6 83.19,81.92 80.01,85.09 58.42,85.09 57.79,85.72 44.45,85.72 43.82,85.09 24.13,85.09 23.5,85.72 13.97,85.72 U$1.BE2
BR2  (via drill 0.61)
  Top 0.305: v26.04,106.68 19.69,113.03 v19.69,114.94
  Bottom 0.305: v26.04,106.68 41.28,106.68 42.55,107.95 87.63,107.95 87.63,120.65 88.27,121.28 89.54,121.28 90.81,120.02 IC6.3 | v19.69,114.94 13.97,114.94 U$1.BR2
BU1  (via drill 0.61)
  Top 0.305: v82.55,128.27 82.55,114.3 83.82,113.03 IC6.9 | v15.88,127 13.97,125.09 U$1.BU1
  Bottom 0.305: v82.55,128.27 60.33,128.27 59.06,127 v15.88,127
BV1
  Top 0.305: IC5.12 92.08,90.81 93.35,89.53 108.59,89.53 108.59,125.09 103.51,130.18 20.32,130.18 20.32,129.54 19.05,128.27 13.97,128.27 U$1.BV1
BV2
  Top 0.305: IC5.11 88.9,92.71 89.54,93.34 89.54,97.16 90.17,97.79 90.17,122.56 88.9,123.83 R2.1
  Bottom 0.305: U$1.BV2 13.97,128.27 59.06,128.27 60.33,129.54 88.27,129.54 90.17,127.64 90.17,125.09 88.9,125.09 R2.1
C0  (via drill 0.61)
  Top 0.305: v17.15,99.69 13.97,96.52 U$1.BJ1
  Bottom 0.305: v17.15,99.69 18.42,100.97 33.66,100.97 34.93,99.69 E13.5
C2  (via drill 0.61)
  Top 0.305: v35.56,95.89 35.56,92.71 E13.10 | v22.23,95.89 21.59,96.52 v21.59,98.42
  Bottom 0.305: v35.56,95.89 34.93,95.25 22.86,95.25 v22.23,95.89 | v21.59,98.42 13.97,98.42 U$1.BK2
DA2  (via drill 0.61)
  Top 0.305: v33.02,115.57 33.02,113.03 IC3.9 | v15.24,116.2 15.24,116.84 13.97,118.11 U$1.BS1
  Bottom 0.305: v33.02,115.57 32.39,116.2 v15.24,116.2
DA_ENABL  (via drill 0.61)
  Top 0.305: v19.69,120.02 25.4,114.3 v25.4,112.39
  Bottom 0.305: IC6.8 80.65,112.39 80.01,112.39 78.74,113.67 32.39,113.67 31.12,112.39 IC3.8 29.85,112.39 v25.4,112.39 | v19.69,120.02 14.61,120.02 13.97,120.65 U$1.BT2
DATA2  (via drill 0.61)
  Top 0.305: v64.77,104.78 64.77,93.98 63.5,92.71 IC1.11
  Bottom 0.305: v64.77,104.78 64.14,104.14 52.71,104.14 51.44,102.87 43.82,102.87 41.28,105.41 24.13,105.41 23.5,104.78 13.97,104.78 U$1.BM2
DATA3  (via drill 0.61)
  Top 0.305: v87.63,70.48 87.63,71.12 88.9,72.39 IC4.11 | v21.59,64.14 19.69,66.04 v19.69,109.86
  Bottom 0.305: v87.63,70.48 81.28,64.14 v21.59,64.14 | v19.69,109.86 18.42,111.12 13.97,111.12 U$1.BP2
DATA_ENABL  (via drill 0.61)
  Top 0.305: v67.31,75.56 67.31,82.55 66.04,83.82 66.04,90.17 IC1.12 66.04,92.71 67.31,93.98 67.31,102.23 v66.04,103.5 | v18.42,103.5 13.97,103.5 U$1.BL1
  Bottom 0.305: v67.31,75.56 89.54,75.56 90.81,74.3 IC4.12 | v18.42,103.5 19.05,102.87 42.55,102.87 43.18,102.23 55.25,102.23 56.52,103.5 v66.04,103.5
GND  (via drill 0.61)  (3 unrouted)
  Top 0.305: E13.7 30.48,100.33 29.21,101.6 29.21,116.84 30.48,118.11 IC3.7 | v15.24,121.28 13.97,121.28 U$1.BT1 | 29.21,43.18 30.48,41.91 E4.7 | 29.21,43.18 29.21,55.88 30.48,57.15 E7.7 | 29.21,43.18 29.21,22.86 30.48,21.59 IC7.7 | v20.96,11.43 22.23,12.7 22.23,19.68 C1.- 22.23,20.95 20.32,22.86 20.32,50.8 13.97,50.8 U$1.AT1 | C2.- 23.5,56.52 24.77,57.78 24.77,81.92 23.5,83.19 C3.- 23.5,84.45 23.5,95.89 v26.04,98.42 | IC8.7 81.28,21.59 79.38,23.5 79.38,55.24 81.28,57.15 E9.7 81.28,59.69 80.01,60.96 80.01,83.82 | 80.01,83.82 81.28,82.55 IC4.7 | 80.01,83.82 80.01,96.52 81.28,97.79 IC5.7 81.28,100.33 81.28,101.6 79.38,103.5 79.38,116.2 81.28,118.11 IC6.7 81.28,120.65 81.28,129.54 98.43,129.54 100.33,127.64 100.33,125.09 106.05,125.09 C5.- | C8.- 106.05,28.57 106.05,40.01 C7.- 106.05,41.27 104.78,42.55 104.78,66.67 106.05,67.94 C6.- | 54.61,38.1 54.61,22.86 55.88,21.59 IC9.7 | 54.61,38.1 55.88,39.37 IC10.7 | 54.61,38.1 54.61,55.88 55.88,57.15 E8.7 55.88,59.69 54.61,60.96 54.61,83.82 | 54.61,83.82 55.88,82.55 E11.7 | 54.61,83.82 54.61,96.52 | 54.61,96.52 55.88,97.79 IC1.7 | 54.61,96.52 54.61,116.84 55.88,118.11 IC2.7
  Bottom 0.305: IC3.7 29.85,120.02 24.77,120.02 23.5,121.28 C4.- 22.23,121.28 v15.24,121.28 | E10.7 29.85,81.92 28.58,83.19 23.5,83.19 C3.- 22.86,83.19 22.86,80.64 13.97,80.64 U$1.BC2 | IC7.7 29.85,19.68 23.5,19.68 C1.- | C2.- 23.5,56.52 24.77,57.78 29.85,57.78 E7.7 31.12,57.78 32.39,56.52 53.98,56.52 55.25,57.78 E8.7 | v20.96,11.43 13.97,11.43 U$1.AC2 | v26.04,98.42 29.85,98.42 E13.7 | C7.- 106.05,41.27 104.78,42.55 57.79,42.55 56.52,41.27 IC10.7 | IC4.7 80.65,80.64 78.74,78.74 58.42,78.74 56.52,80.64 E11.7
IO2  (via drill 0.61)
  Top 0.305: v59.69,97.16 59.69,100.33 59.06,100.97 59.06,109.86 58.42,110.49 IC2.9 | v15.24,100.97 13.97,99.69 U$1.BK1
  Bottom 0.305: v59.69,97.16 37.47,97.16 36.83,97.79 36.83,101.6 15.88,101.6 v15.24,100.97
IO3  (via drill 0.61)
  Top 0.305: v80.65,114.94 82.55,113.03 82.55,93.98 83.82,92.71 IC5.9 | v49.53,116.2 47.63,118.11 47.63,125.09 45.72,127 18.42,127 18.42,110.49 13.97,106.05 U$1.BM1
  Bottom 0.305: v80.65,114.94 79.38,116.2 v49.53,116.2
IO_ENABL  (via drill 0.61)
  Top 0.305: v57.15,102.23 57.15,109.22 55.88,110.49 IC2.8
  Bottom 0.305: 57.15,101.6 40.64,101.6 40.01,102.23 13.97,102.23 U$1.BL2 | 57.15,101.6 71.12,101.6 80.65,92.08 IC5.8 | 57.15,101.6 v57.15,102.23
MA2_H  (via drill 0.61)
  Top 0.305: v33.02,36.83 35.56,39.37 E4.5 | v45.72,116.2 45.72,116.84 43.82,118.75 IC3.2 | v48.26,115.57 47.63,114.94 v47.63,42.55
  Bottom 0.305: v33.02,36.83 13.97,36.83 U$1.AM2 | v45.72,116.2 46.36,115.57 v48.26,115.57 | v47.63,42.55 37.47,42.55 36.2,41.27 E4.5
MA2_L  (via drill 0.61)
  Top 0.305: v17.78,39.37 15.24,39.37 15.24,37.47 13.97,36.2 U$1.AM1
  Bottom 0.305: v17.78,39.37 18.42,38.73 31.12,38.73 32.39,40.01 E4.6
MA3_H  (via drill 0.61)
  Top 0.305: v35.56,26.04 33.02,28.57 33.02,31.75 E4.9
  Bottom 0.305: E4.9 32.39,32.38 31.12,31.11 14.61,31.11 13.97,31.75 U$1.AL2 | v35.56,26.04 38.1,26.04 39.37,27.3 54.61,27.3 57.15,29.84 108.59,29.84 108.59,109.86 97.16,121.28 95.89,121.28 94.62,120.02 IC6.2
MA3_L  (via drill 0.61)
  Top 0.305: v15.24,32.38 13.97,32.38 U$1.AL1
  Bottom 0.305: v15.24,32.38 29.85,32.38 E4.8
MA_ENABL  (via drill 0.61)
  Top 0.305: v36.2,123.83 40.01,120.02 IC3.3 | v16.51,123.83 16.51,113.03 15.88,112.39 13.97,112.39 U$1.BP1
  Bottom 0.305: v16.51,123.83 v36.2,123.83
MB2_H
  Top 0.305: E11.2 69.22,80.64 70.49,80.64 E11.1 | E8.5 60.96,59.69 59.69,60.96 59.69,78.74 60.96,80.01 E11.5 61.6,80.64 62.87,80.64 E11.4
  Bottom 0.305: E11.2 67.95,80.64 66.68,79.38 65.41,79.38 64.14,80.64 E11.4
MB2_L  (via drill 0.61)
  Top 0.305: E11.12 66.68,73.03 67.95,73.03 E11.13 | v52.71,52.7 52.71,10.79 45.09,10.79 44.45,11.43 44.45,17.78 43.18,19.05 IC7.2 | E11.9 58.42,72.39 58.42,59.69 E8.6
  Bottom 0.305: E11.9 59.06,73.03 60.33,73.03 E11.10 61.6,74.3 62.87,75.56 64.14,75.56 65.41,74.3 E11.12 | v52.71,52.7 55.25,55.24 57.79,55.24 58.42,55.88 58.42,57.15 E8.6
MB3_H
  Top 0.305: E7.5 36.2,57.78 37.47,57.78 E7.4 | E7.2 43.82,57.78 45.09,57.78 E7.1
  Bottom 0.305: 47.63,60.33 64.77,60.33 64.77,57.15 64.14,56.52 62.87,56.52 58.42,52.07 E8.9 | 47.63,60.33 46.36,59.05 E7.1 | 47.63,60.33 40.01,60.33 38.74,59.05 E7.4
MB3_L
  Top 0.305: E7.9 33.66,50.16 34.93,50.16 E7.10 | IC9.2 68.58,21.59 67.31,22.86 67.31,59.69 66.68,60.33 62.23,60.33 62.23,57.15 56.52,51.44 E8.8
  Bottom 0.305: E7.12 41.28,50.16 42.55,50.16 E7.13 43.82,50.16 45.09,48.9 | 45.09,48.9 53.98,48.9 55.25,50.16 E8.8 | 45.09,48.9 37.47,48.9 36.2,50.16 E7.10
MEM2  (via drill 0.61)
  Top 0.305: v64.77,127 64.77,114.3 63.5,113.03 IC2.11 | v15.24,113.67 15.24,114.3 13.97,114.3 U$1.BR1
  Bottom 0.305: 85.09,127 88.27,127 R1.1 | 85.09,127 v64.77,127 | v15.24,113.67 31.12,113.67 31.75,114.3 79.38,114.3 80.01,113.67 81.28,113.67 85.09,117.47 85.09,127
MEM_ENABL  (via drill 0.61)
  Top 0.305: v67.31,124.46 67.31,114.3 66.04,113.03 IC2.12
  Bottom 0.305: v67.31,124.46 66.04,125.73 29.21,125.73 27.94,124.46 17.78,124.46 17.15,125.09 13.97,125.09 U$1.BU2
MQ2_H  (via drill 0.61)
  Top 0.305: v67.31,88.27 67.31,92.71 67.95,93.34 67.95,97.16 68.58,97.79 IC1.2 | v35.56,88.9 34.29,90.17 v34.29,96.52 | v17.78,97.16 13.97,93.34 U$1.BH1
  Bottom 0.305: v67.31,88.27 66.68,88.9 v35.56,88.9 | v34.29,96.52 33.66,97.16 v17.78,97.16
MQ3_H  (via drill 0.61)
  Top 0.305: v34.93,108.58 37.47,111.12 IC3.11
  Bottom 0.305: v34.93,108.58 13.97,108.58 U$1.BN2
MQ_ENABL  (via drill 0.61)
  Top 0.305: IC3.12 40.64,110.49 39.37,109.22 v39.37,100.97 39.37,95.25 v38.74,94.61 | v17.15,94.61 17.15,90.81 13.97,90.81 U$1.BF1
  Bottom 0.305: v39.37,100.97 64.14,100.97 65.41,99.69 IC1.3 | v17.15,94.61 17.78,93.98 38.1,93.98 v38.74,94.61
N$1  (1 unrouted)
N$2  (1 unrouted)
N$3  (2 unrouted)
N$4  (1 unrouted)
N$5
  Top 0.305: IC2.4 63.5,118.11 63.5,115.57 60.96,113.03 IC2.10 60.96,110.49 63.5,107.95 63.5,100.33 IC1.4 63.5,97.79 60.96,95.25 60.96,92.71 IC1.10 | IC1.13 68.58,92.71 71.12,95.25 71.12,97.79 IC1.1 | R8.1 41.28,124.46 46.99,124.46 46.99,93.98 45.72,92.71 E13.14
  Bottom 0.305: IC2.1 70.49,120.02 69.22,121.28 65.41,121.28 64.14,120.02 IC2.4 | 59.06,89.53 47.63,89.53 46.36,90.81 E13.14 | 59.06,89.53 60.33,90.81 IC1.10 | 59.06,89.53 66.68,89.53 67.95,90.81 IC1.13
N$7  (1 unrouted)
N$8  (via drill 0.61)
  Top 0.305: 43.18,105.41 43.18,110.49 IC3.13 | 43.18,105.41 43.18,100.33 E13.2 | IC4.13 93.98,74.93 96.52,77.47 96.52,80.01 IC4.1 | IC4.10 86.36,74.93 88.9,77.47 88.9,80.01 IC4.4 88.9,82.55 86.36,85.09 86.36,90.17 IC5.10 86.36,92.71 88.9,95.25 88.9,97.79 IC5.4 88.9,100.33 88.9,103.5 R10.1 | 43.18,105.41 v43.82,105.41
  Bottom 0.305: IC5.1 95.89,99.69 91.44,104.14 89.54,104.14 R10.1 88.27,104.14 84.46,104.14 82.55,106.05 64.14,106.05 63.5,105.41 v43.82,105.41 | IC4.13 93.35,73.03 92.08,71.75 88.27,71.75 87,73.03 IC4.10
N$9  (1 unrouted)
N$10  (1 unrouted)
N$11  (2 unrouted)
N$12  (via drill 0.61)
  Top 0.305: 38.1,116.84 38.1,118.11 IC3.4 | 38.1,116.84 38.1,115.57 35.56,113.03 IC3.10 | 38.1,116.84 41.91,113.03 41.91,93.98 43.18,92.71 E13.13 43.18,90.17 v43.18,86.36
  Bottom 0.305: v43.18,86.36 60.33,86.36 R9.1 | IC2.13 67.95,111.12 66.68,109.86 37.47,109.86 36.2,111.12 IC3.10 | IC3.1 45.09,120.02 43.82,121.28 40.01,121.28 38.74,120.02 IC3.4
N$13  (3 unrouted)
N$14  (via drill 0.61)
  Top 0.305: IC5.13 93.98,92.71 95.25,93.98 95.25,116.84 96.52,118.11 IC6.1 | E13.3 40.64,100.33 40.64,103.5 R11.1 40.64,104.78 v40.64,107.95 | IC6.10 86.36,113.03 88.9,115.57 88.9,118.11 IC6.4
  Bottom 0.305: v40.64,107.95 41.91,109.22 83.82,109.22 85.73,111.12 IC6.10 | IC6.1 95.89,118.75 94.62,117.47 90.81,117.47 89.54,118.75 IC6.4
N$15  (1 unrouted)
N$16  (1 unrouted)
N$17  (1 unrouted)
N$19  (1 unrouted)
N$22  (2 unrouted)
N$25  (2 unrouted)
N$26  (1 unrouted)
NO_SHIFT  (via drill 0.61)
  Top 0.305: v15.24,17.14 13.97,17.14 U$1.AE1
  Bottom 0.305: IC9.8 55.25,13.34 53.34,15.24 35.56,15.24 33.66,13.34 IC7.9 32.39,13.34 28.58,17.14 v15.24,17.14
PC2_H  (via drill 0.61)
  Top 0.305: v85.09,47.62 85.09,52.07 85.73,52.7 85.73,56.52 86.36,57.15 E9.5 | v15.24,42.55 13.97,42.55 U$1.AP1 | v26.04,121.28 26.67,120.65 26.67,107.95 27.31,107.31 27.31,92.71 26.04,91.44 v26.04,43.18
  Bottom 0.305: v85.09,47.62 81.92,44.45 33.02,44.45 31.75,43.18 v26.04,43.18 15.88,43.18 v15.24,42.55 | v26.04,121.28 33.66,121.28 34.93,120.02 IC3.5
PC2_L  (via drill 0.61)
  Top 0.305: v30.48,45.09 v33.66,48.26
  Bottom 0.305: v33.66,48.26 59.69,48.26 59.69,52.07 60.96,53.34 67.31,53.34 67.31,59.69 67.95,60.33 81.92,60.33 83.19,59.05 E9.6 | v30.48,45.09 13.97,45.09 U$1.AR2
PC3_H  (via drill 0.61)
  Top 0.305: IC6.5 86.36,118.11 85.09,116.84 85.09,53.34 83.82,52.07 E9.9 83.82,49.53 v81.92,47.62 | v16.51,47.62 16.51,40.01 13.97,40.01 U$1.AN1
  Bottom 0.305: v16.51,47.62 17.15,46.99 61.6,46.99 62.87,48.26 81.28,48.26 v81.92,47.62
PC3_L  (via drill 0.61)
  Top 0.305: v80.65,46.99 80.65,48.9 81.28,49.53 E9.8
  Bottom 0.305: v80.65,46.99 78.74,45.09 32.39,45.09 31.12,43.81 27.31,43.81 26.67,44.45 15.88,44.45 15.24,43.81 14.61,43.81 13.97,43.18 U$1.AP2
PC_ENABL
  Bottom 0.305: 31.12,117.47 32.39,118.75 IC3.6 | 31.12,117.47 13.97,117.47 U$1.BS2 | 31.12,117.47 81.92,117.47 83.19,118.75 IC6.6
SC2  (via drill 0.61)
  Top 0.305: v60.96,127 60.96,120.65 IC2.5 | v27.31,125.73 27.31,108.58 27.94,107.95 27.94,92.08 27.31,91.44 v27.31,87 | v18.42,87 13.97,82.55 U$1.BD1
  Bottom 0.305: v60.96,127 60.33,126.36 27.94,126.36 v27.31,125.73 | v18.42,87 v27.31,87
SC3  (via drill 0.61)
  Top 0.305: v78.74,102.23 73.03,107.95 73.03,120.65 65.41,128.27 20.32,128.27 19.69,127.64 17.78,127.64 17.78,113.03 13.97,109.22 U$1.BN1
  Bottom 0.305: v78.74,102.23 83.19,102.23 85.73,99.69 IC5.5
SC_ENABL  (via drill 0.61)
  Top 0.305: v62.23,106.68 59.69,109.22 59.69,116.84 58.42,118.11 IC2.6 | v83.82,106.68 83.82,100.33 IC5.6 | v28.58,90.81 v28.58,122.56
  Bottom 0.305: v62.23,106.68 v83.82,106.68 | v28.58,90.81 13.97,90.81 U$1.BF2 | v28.58,122.56 29.21,121.92 55.88,121.92 57.79,120.02 IC2.6
SHIFT_L1  (via drill 0.61)
  Top 0.305: v93.35,17.14 93.98,17.78 93.98,19.05 IC8.2
  Bottom 0.305: v93.35,17.14 83.19,17.14 76.84,10.79 67.95,10.79 66.68,12.06 IC9.12 | U$1.AF2 13.97,20.95 14.61,21.59 21.59,21.59 22.86,22.86 91.44,22.86 93.35,20.95 IC8.2
SHIFT_L2  (via drill 0.61)
  Top 0.305: v80.65,38.1 83.82,34.92 83.82,21.59 IC8.6 | v17.15,38.1 17.15,24.13 13.97,24.13 U$1.AH1
  Bottom 0.305: 60.96,38.1 59.06,40.01 IC10.6 | 60.96,38.1 v80.65,38.1 | v17.15,38.1 60.96,38.1
SHIFT_R1  (via drill 0.61)
  Top 0.305: v35.56,10.16 36.83,11.43 | 36.83,11.43 37.47,12.06 IC7.11 | v68.58,36.83 68.58,39.37 IC10.2 | v37.47,35.56 36.83,34.92 36.83,11.43
  Bottom 0.305: v35.56,10.16 34.93,10.79 23.5,10.79 21.59,12.7 13.97,12.7 U$1.AD2 | v68.58,36.83 67.31,35.56 v37.47,35.56
SHIFT_R2  (via drill 0.61)
  Top 0.305: v18.42,18.41 13.97,13.97 U$1.AD1
  Bottom 0.305: IC9.5 60.33,20.95 59.06,22.23 37.47,22.23 36.2,20.95 IC7.5 34.93,19.68 33.66,18.41 v18.42,18.41
SR2  (via drill 0.61)
  Top 0.305: v68.58,122.56 68.58,120.65 IC2.2 | v38.74,123.19 36.83,125.09 31.75,125.09 v31.75,89.53 | v15.24,88.27 13.97,87 U$1.BE1
  Bottom 0.305: v68.58,122.56 67.95,123.19 v38.74,123.19 | v31.75,89.53 30.48,88.27 v15.24,88.27
SR3  (via drill 0.61)
  Top 0.305: v23.5,76.2 21.59,78.11 v21.59,81.92
  Bottom 0.305: v23.5,76.2 24.13,76.83 100.33,76.83 100.33,91.44 93.98,97.79 IC5.2 | v21.59,81.92 20.96,82.55 13.97,82.55 U$1.BD2
SR_ENABL  (via drill 0.61)
  Top 0.305: v71.12,104.14 64.77,110.49 64.77,113.03 65.41,113.67 65.41,117.47 66.04,118.11 IC2.3 | v18.42,76.83 18.42,80.64 13.97,80.64 U$1.BC1 | v86.36,71.12 87.63,72.39 87.63,74.93 90.17,77.47 90.17,96.52 91.44,97.79 IC5.3
  Bottom 0.305: v71.12,104.14 71.76,103.5 87,103.5 90.81,99.69 IC5.3 | v18.42,76.83 24.13,71.12 v86.36,71.12
TT_SHIFT
  Top 0.305: R4.1 60.96,28.57 58.42,31.11 58.42,31.75 IC10.9
  Bottom 0.305: 92.08,10.79 85.73,10.79 84.46,12.06 IC8.9 | 92.08,10.79 93.35,12.06 IC8.13 | 92.08,10.79 97.79,10.79 97.79,21.59 92.71,26.67 62.87,26.67 61.6,27.94 R4.1
VCC  (via drill 0.61)  (5 unrouted)
  Top 0.305: C4.+ 22.23,106.05 20.32,104.14 20.32,71.12 22.23,69.22 C3.+ 22.86,67.94 22.86,63.5 20.96,61.59 20.96,42.55 22.23,41.27 C2.+ 23.5,40.01 24.77,38.73 24.77,6.99 23.5,5.71 C1.+ | E4.10 35.56,34.29 36.2,34.92 36.2,37.47 38.1,39.37 E4.4 | IC7.14 45.72,13.97 46.99,15.24 46.99,30.48 45.72,31.75 E4.14 45.72,34.29 45.72,39.37 E4.1 45.72,41.91 45.72,49.53 E7.14 45.72,52.07 46.99,53.34 46.99,71.12 45.72,72.39 E10.14 | 36.83,78.74 38.1,80.01 E10.4 | 36.83,78.74 36.2,78.11 36.2,75.56 35.56,74.93 E10.10 35.56,72.39 35.56,70.48 v34.29,69.22 | 36.83,78.74 36.83,96.52 38.1,97.79 E13.4 | 50.8,111.12 50.8,123.83 R8.2 | 50.8,111.12 50.8,104.78 R11.2 | E10.13 43.82,73.03 45.09,73.03 E10.14 | E10.14 45.72,74.93 45.72,80.01 E10.1 45.72,82.55 44.45,83.82 44.45,100.33 45.09,100.97 45.09,109.86 45.72,110.49 IC3.14 | v48.9,111.12 50.8,111.12 | IC9.14 71.12,13.97 72.39,15.24 72.39,23.5 71.12,24.77 R13.2 71.12,26.04 71.12,27.3 R4.2 71.12,28.57 71.12,31.75 IC10.14 71.12,34.29 69.85,35.56 69.85,50.16 | IC2.14 71.12,110.49 72.39,109.22 72.39,93.98 71.12,92.71 IC1.14 71.12,90.17 71.12,87 R9.2 71.12,85.72 72.39,84.45 72.39,76.2 71.12,74.93 E11.14 71.12,72.39 71.12,59.69 E8.1 71.12,57.15 71.12,52.07 E8.14 70.49,50.16 69.85,50.16 | E8.10 60.96,52.07 63.5,54.61 63.5,57.15 E8.4 | 69.85,50.16 69.22,50.16 E8.13 | 99.06,83.19 99.06,85.72 R5.2 | 99.06,83.19 99.06,77.47 96.52,74.93 IC4.14 96.52,72.39 96.52,59.69 E9.1 96.52,57.15 96.52,52.07 E9.14 | 99.06,83.19 106.05,83.19 C6.+ | IC6.14 96.52,110.49 96.52,107.31 99.06,104.78 R10.2 99.06,103.5 99.06,95.25 96.52,92.71 IC5.14
  Top 0.305: R1.2 99.06,126.36 99.06,125.09 R2.2 99.06,123.83 106.05,116.84 106.05,109.86 C5.+ | C8.+ 106.05,12.06 102.24,8.26 102.24,7.62 R3.2 100.97,7.62 97.16,11.43 97.16,12.06 IC8.14 96.52,13.97 95.25,15.24 95.25,21.59 93.35,23.5 93.35,48.9 | E9.4 88.9,57.15 88.9,54.61 86.36,52.07 E9.10 87,50.16 88.27,48.9 93.35,48.9 | 93.35,48.9 93.35,50.16 E9.13
  Bottom 0.305: C1.+ 22.23,4.45 13.97,4.45 U$1.AA2 | U$1.BA2 13.97,73.66 15.88,73.66 20.32,69.22 22.23,69.22 C3.+ 23.5,69.22 v34.29,69.22 | E4.13 43.82,32.38 45.09,32.38 E4.14 | E4.4 38.74,40.01 40.01,38.73 43.82,38.73 45.09,40.01 E4.1 | v48.9,111.12 46.36,111.12 IC3.14 | E10.10 36.2,74.3 37.47,75.56 41.28,75.56 42.55,74.3 E10.13 | R12.2 56.52,25.4 57.79,24.13 69.22,24.13 70.49,25.4 R13.2 | E8.10 61.6,50.16 62.87,48.9 66.68,48.9 67.95,50.16 E8.13 | IC5.14 96.52,90.17 96.52,87 99.06,87 R5.2 | R10.2 99.7,104.14 104.14,108.58 106.05,108.58 C5.+ | IC8.11 89.54,13.34 90.81,14.61 94.62,14.61 95.89,13.34 IC8.14 | E9.13 94.62,50.16 95.89,50.16 E9.14 | C7.+ 106.05,56.52 104.78,57.78 97.16,57.78 E9.1 | E8.14 71.76,50.16 73.03,48.9 84.46,48.9 85.73,50.16 E9.10 | E7.14 46.36,51.44 53.98,51.44 57.15,54.61 59.69,54.61 62.87,57.78 E8.4